# Altium schematic sheet main.SchDoc
size 699 x 699 mm; SheetNumber: 1; SheetTotal: 1
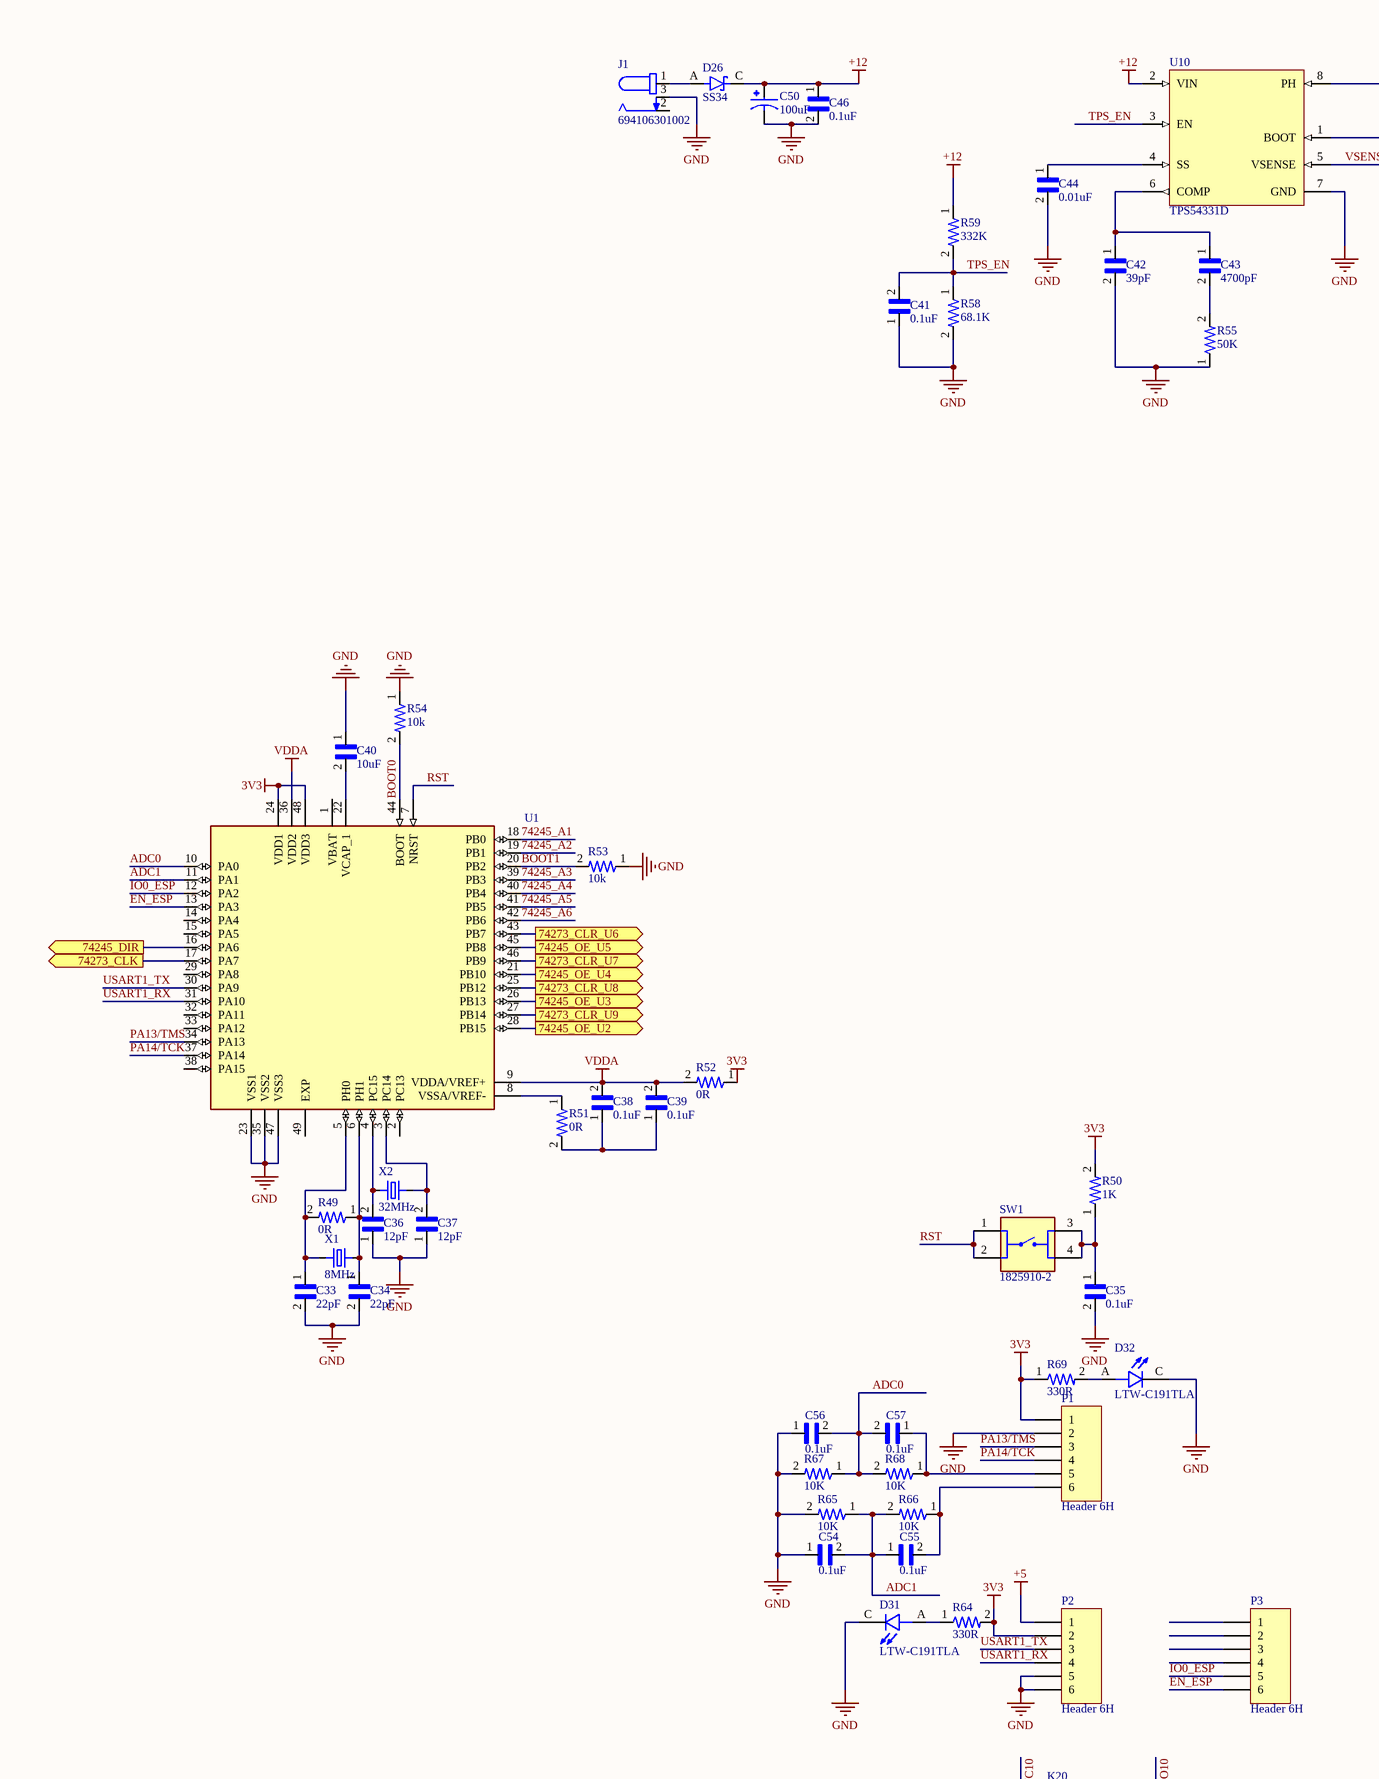
[diagram p0: main.SchDoc, top left]
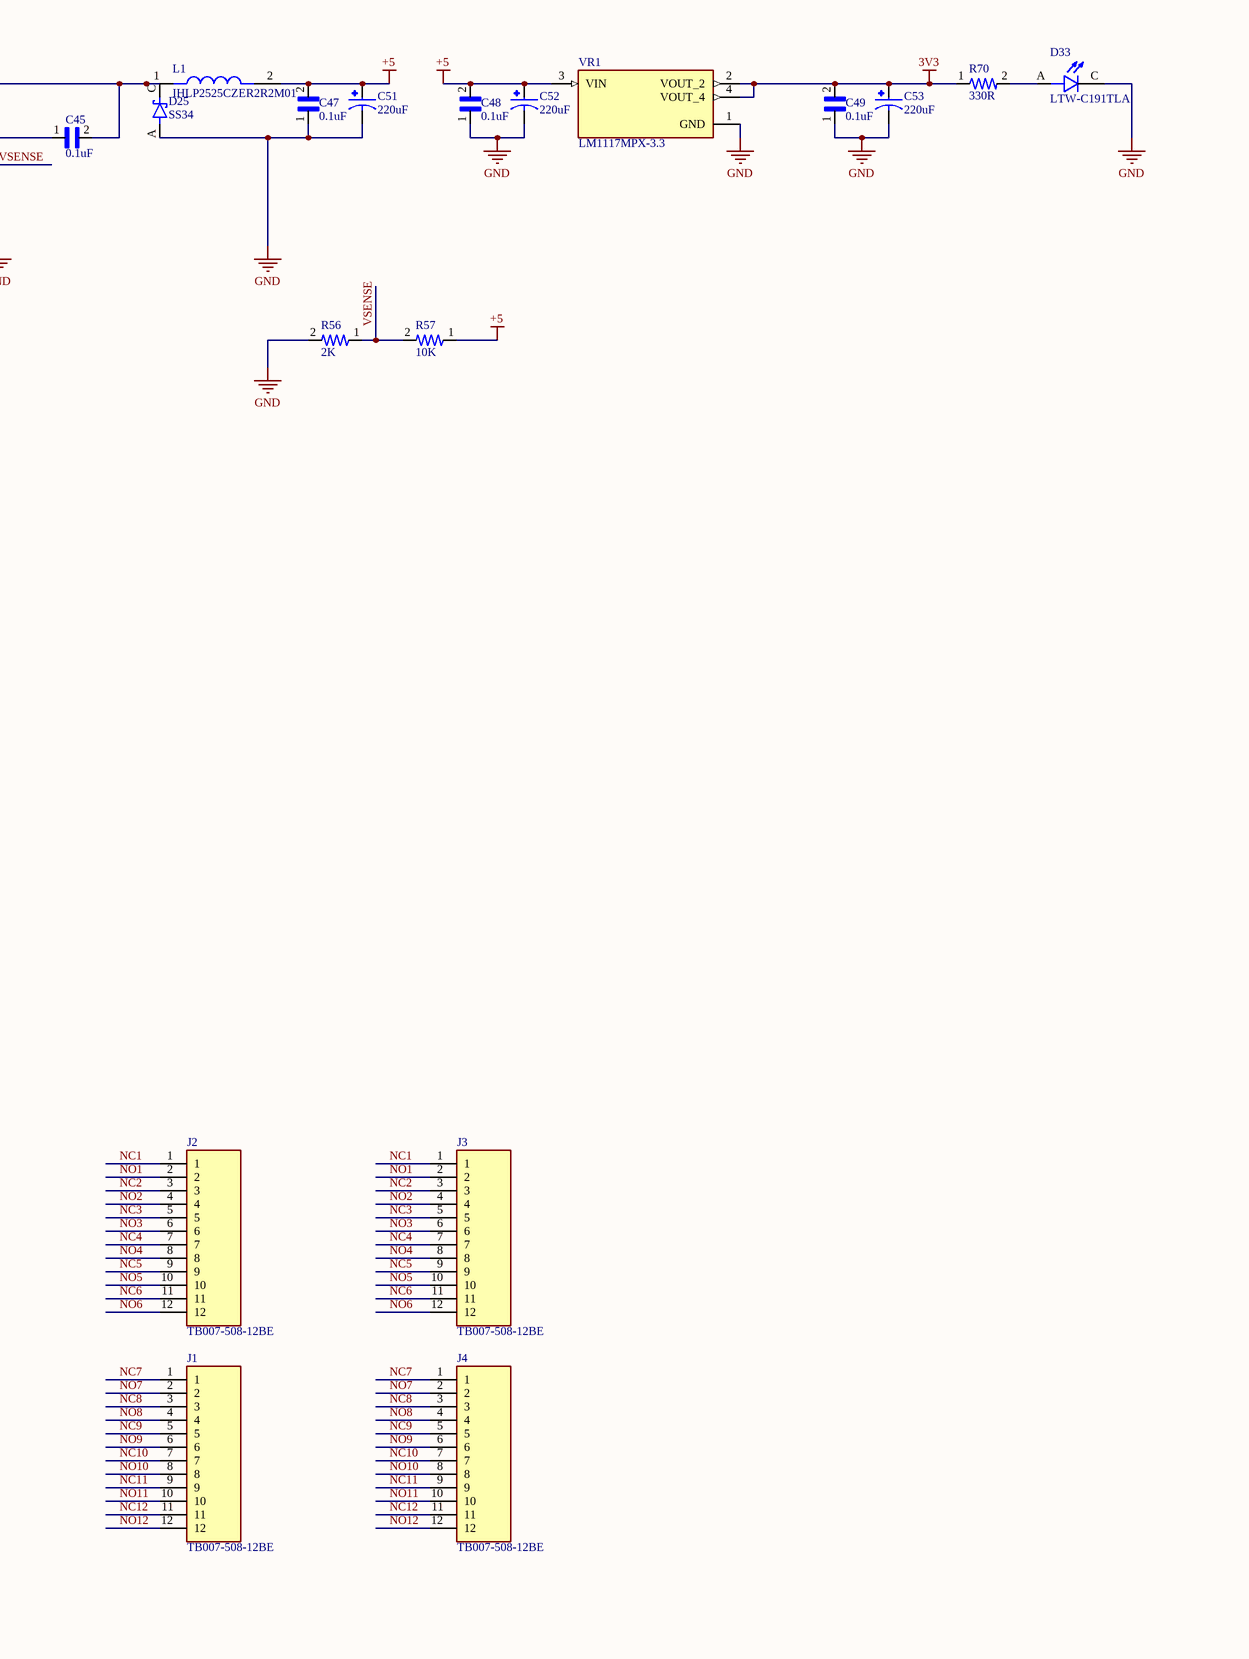
[diagram p1: main.SchDoc, top right]
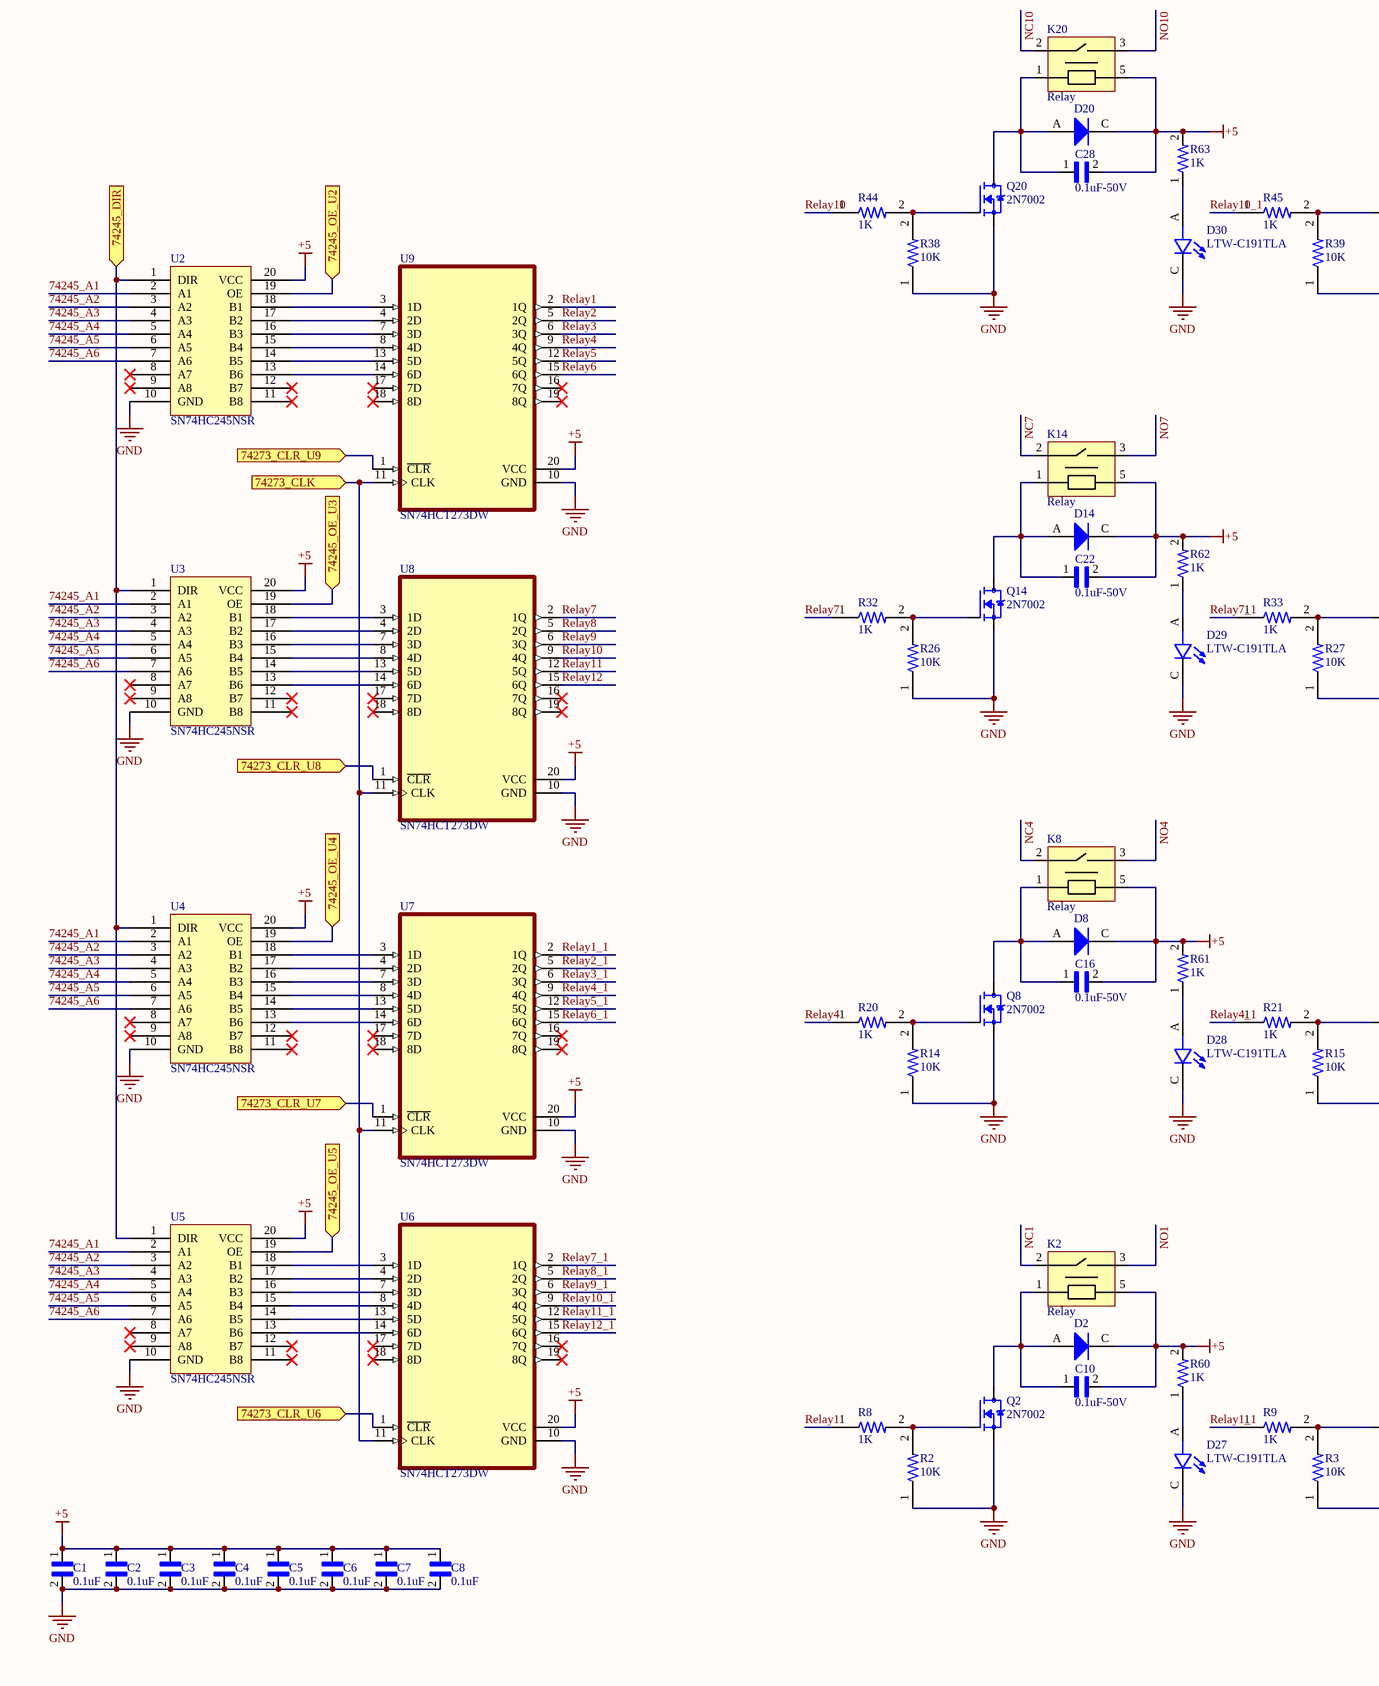
[diagram p2: main.SchDoc, bottom left]
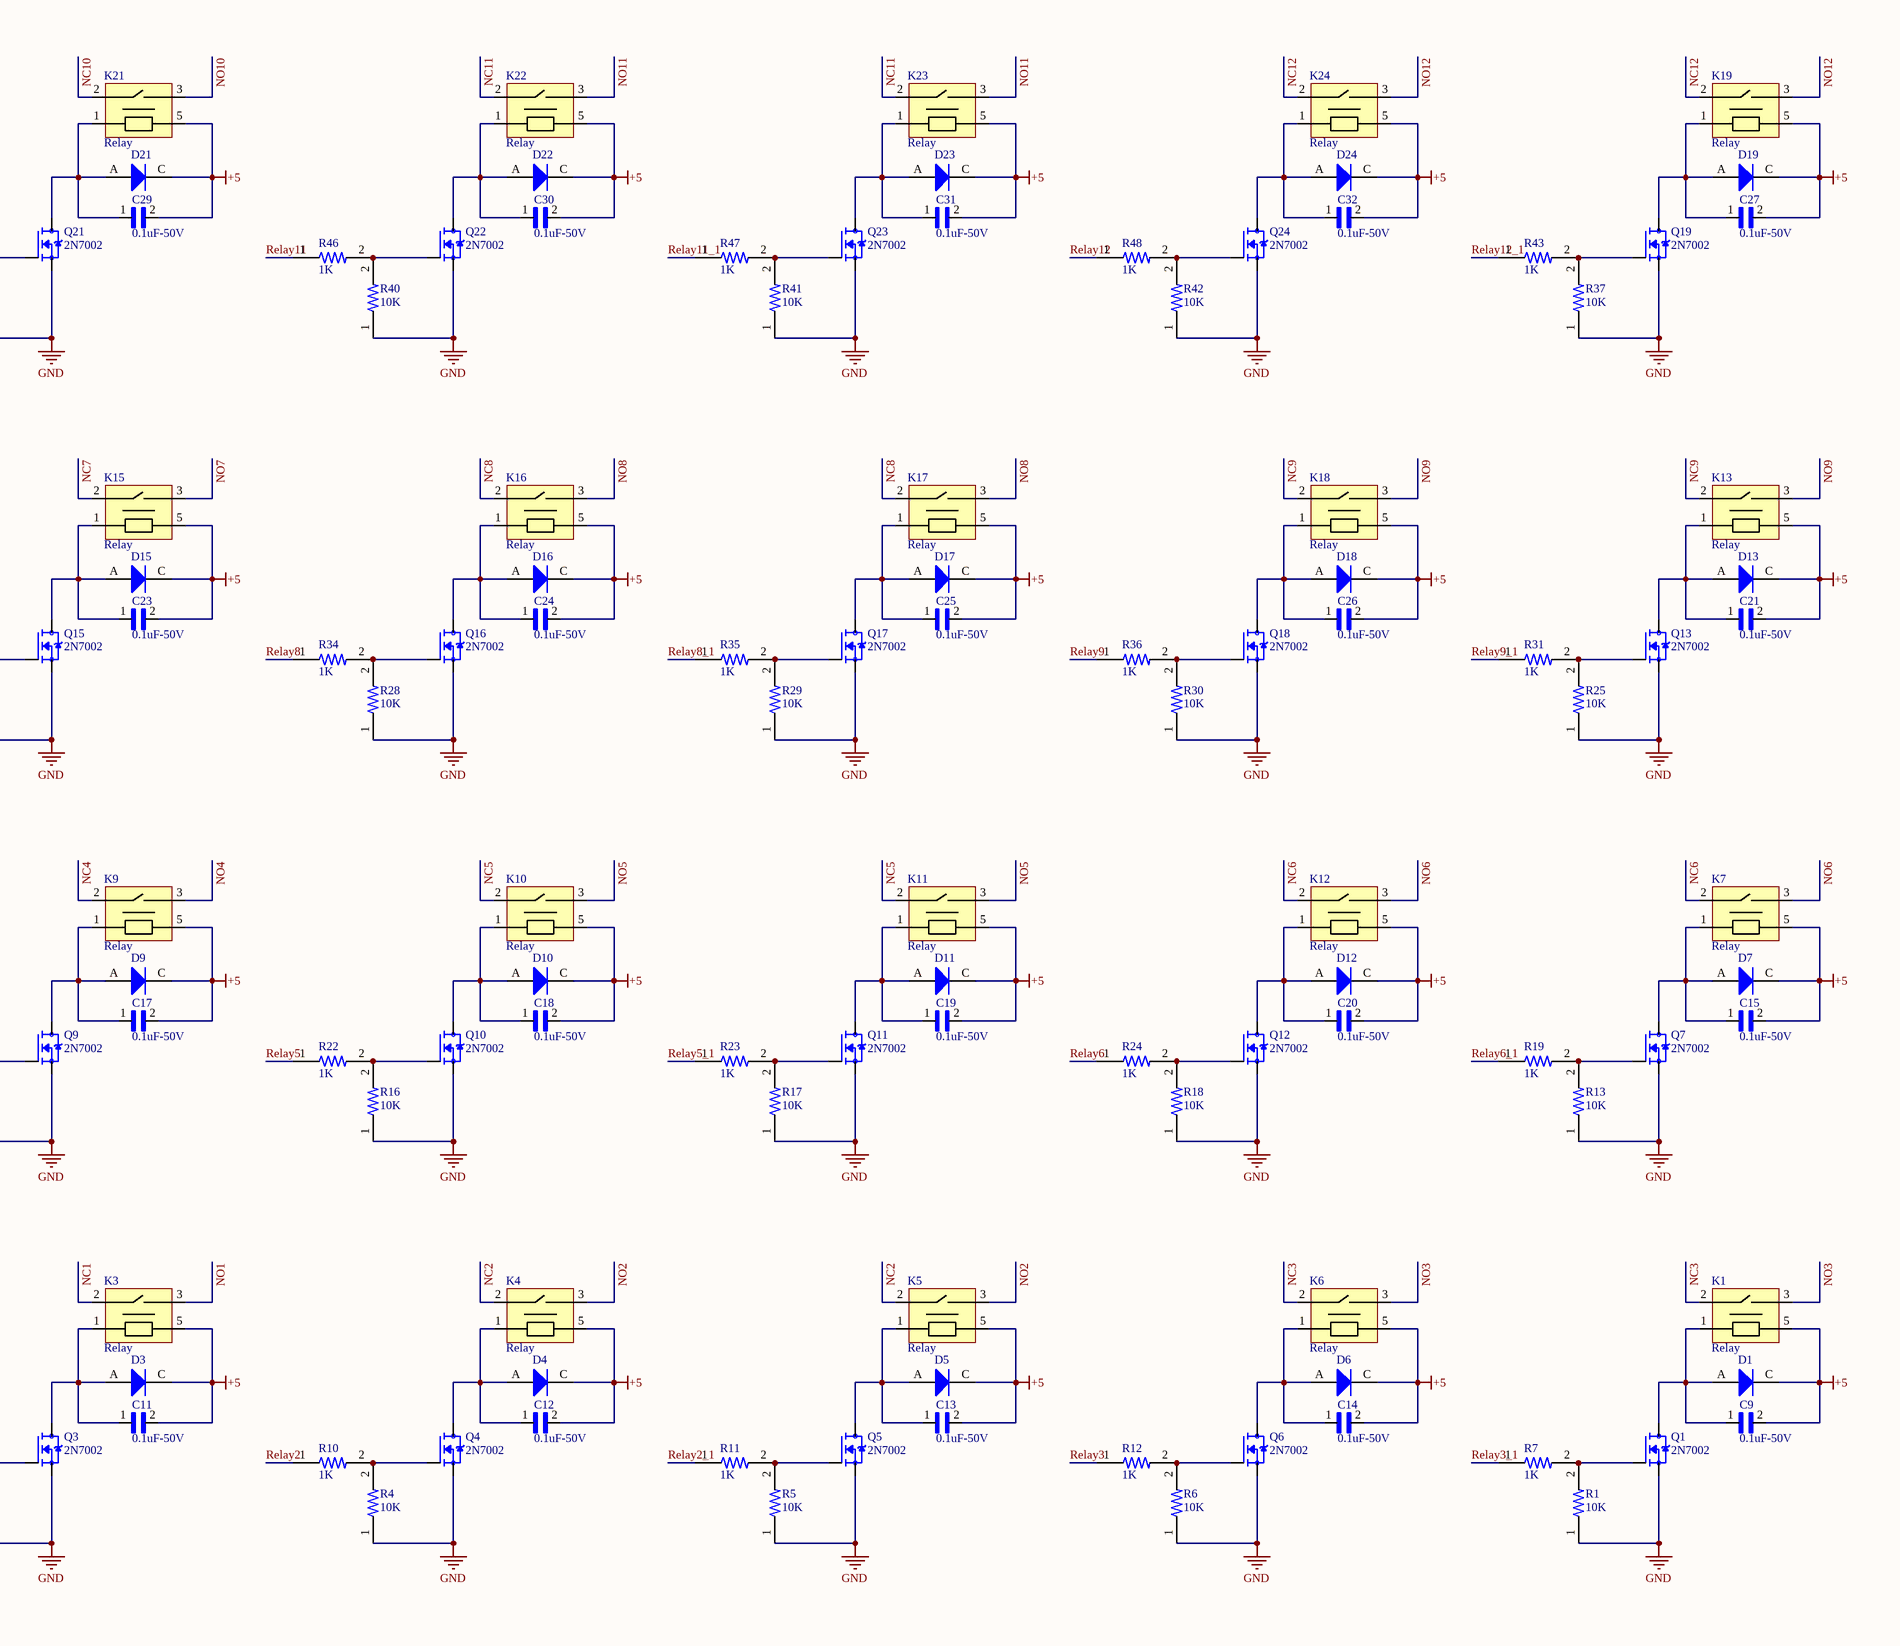
[diagram p3: main.SchDoc, bottom right]

## Parts
(Parts that share a designator on the sheet are numbered #1, #2 ... from top to bottom, then left to right.)
C1  0.1uF  [CAPC1608X90]
C2  0.1uF  [CAPC1608X90]
C3  0.1uF  [CAPC1608X90]
C4  0.1uF  [CAPC1608X90]
C5  0.1uF  [CAPC1608X90]
C6  0.1uF  [CAPC1608X90]
C7  0.1uF  [CAPC1608X90]
C8  0.1uF  [CAPC1608X90]
C9  0.1uF-50V  [CAPC1608X90N]
C10  0.1uF-50V  [CAPC1608X90N]
C11  0.1uF-50V  [CAPC1608X90N]
C12  0.1uF-50V  [CAPC1608X90N]
C13  0.1uF-50V  [CAPC1608X90N]
C14  0.1uF-50V  [CAPC1608X90N]
C15  0.1uF-50V  [CAPC1608X90N]
C16  0.1uF-50V  [CAPC1608X90N]
C17  0.1uF-50V  [CAPC1608X90N]
C18  0.1uF-50V  [CAPC1608X90N]
C19  0.1uF-50V  [CAPC1608X90N]
C20  0.1uF-50V  [CAPC1608X90N]
C21  0.1uF-50V  [CAPC1608X90N]
C22  0.1uF-50V  [CAPC1608X90N]
C23  0.1uF-50V  [CAPC1608X90N]
C24  0.1uF-50V  [CAPC1608X90N]
C25  0.1uF-50V  [CAPC1608X90N]
C26  0.1uF-50V  [CAPC1608X90N]
C27  0.1uF-50V  [CAPC1608X90N]
C28  0.1uF-50V  [CAPC1608X90N]
C29  0.1uF-50V  [CAPC1608X90N]
C30  0.1uF-50V  [CAPC1608X90N]
C31  0.1uF-50V  [CAPC1608X90N]
C32  0.1uF-50V  [CAPC1608X90N]
C33  22pF  [CAPC1608X90]
C34  22pF  [CAPC1608X90]
C35  0.1uF  [CAPC1608X90]
C36  12pF  [CAPC1608X90]
C37  12pF  [CAPC1608X90]
C38  0.1uF  [CAPC1608X90]
C39  0.1uF  [CAPC1608X90]
C40  10uF  [CAPC1608X90]
C41  0.1uF  [CAPC1608X90]
C42  39pF  [CAPC1608X90]
C43  4700pF  [CAPC1608X90]
C44  0.01uF  [CAPC1608X90]
C45  0.1uF  [CAPC1608X90]
C46  0.1uF  [CAPC1608X90]
C47  0.1uF  [CAPC1608X90]
C48  0.1uF  [CAPC1608X90]
C49  0.1uF  [CAPC1608X90]
C50  100uF  [CAP_EEEFKV101XAV]
C51  220uF  [CAP_EEEFN1V221V]
C52  220uF  [CAP_EEEFN1V221V]
C53  220uF  [CAP_EEEFN1V221V]
C54  0.1uF  [CAPC1608X90]
C55  0.1uF  [CAPC1608X90]
C56  0.1uF  [CAPC1608X90]
C57  0.1uF  [CAPC1608X90]
D1  BAS20HT1G  [DIO_1N4148WS-G_RVG]  (value not drawn)
D2  BAS20HT1G  [DIO_1N4148WS-G_RVG]  (value not drawn)
D3  BAS20HT1G  [DIO_1N4148WS-G_RVG]  (value not drawn)
D4  BAS20HT1G  [DIO_1N4148WS-G_RVG]  (value not drawn)
D5  BAS20HT1G  [DIO_1N4148WS-G_RVG]  (value not drawn)
D6  BAS20HT1G  [DIO_1N4148WS-G_RVG]  (value not drawn)
D7  BAS20HT1G  [DIO_1N4148WS-G_RVG]  (value not drawn)
D8  BAS20HT1G  [DIO_1N4148WS-G_RVG]  (value not drawn)
D9  BAS20HT1G  [DIO_1N4148WS-G_RVG]  (value not drawn)
D10  BAS20HT1G  [DIO_1N4148WS-G_RVG]  (value not drawn)
D11  BAS20HT1G  [DIO_1N4148WS-G_RVG]  (value not drawn)
D12  BAS20HT1G  [DIO_1N4148WS-G_RVG]  (value not drawn)
D13  BAS20HT1G  [DIO_1N4148WS-G_RVG]  (value not drawn)
D14  BAS20HT1G  [DIO_1N4148WS-G_RVG]  (value not drawn)
D15  BAS20HT1G  [DIO_1N4148WS-G_RVG]  (value not drawn)
D16  BAS20HT1G  [DIO_1N4148WS-G_RVG]  (value not drawn)
D17  BAS20HT1G  [DIO_1N4148WS-G_RVG]  (value not drawn)
D18  BAS20HT1G  [DIO_1N4148WS-G_RVG]  (value not drawn)
D19  BAS20HT1G  [DIO_1N4148WS-G_RVG]  (value not drawn)
D20  BAS20HT1G  [DIO_1N4148WS-G_RVG]  (value not drawn)
D21  BAS20HT1G  [DIO_1N4148WS-G_RVG]  (value not drawn)
D22  BAS20HT1G  [DIO_1N4148WS-G_RVG]  (value not drawn)
D23  BAS20HT1G  [DIO_1N4148WS-G_RVG]  (value not drawn)
D24  BAS20HT1G  [DIO_1N4148WS-G_RVG]  (value not drawn)
D25  SS34  [DIOM7959X265N]
D26  SS34  [DIOM7959X265N]
D27  LTW-C191TLA  [LEDC1608X65N]
D28  LTW-C191TLA  [LEDC1608X65N]
D29  LTW-C191TLA  [LEDC1608X65N]
D30  LTW-C191TLA  [LEDC1608X65N]
D31  LTW-C191TLA  [LEDC1608X65N]
D32  LTW-C191TLA  [LEDC1608X65N]
D33  LTW-C191TLA  [LEDC1608X65N]
J1#1  694106301002  [69410X301002]
J1#2  TB007-508-12BE  [CUI_TB007-508-12BE]
J2  TB007-508-12BE  [CUI_TB007-508-12BE]
J3  TB007-508-12BE  [CUI_TB007-508-12BE]
J4  TB007-508-12BE  [CUI_TB007-508-12BE]
K1  Relay  [Relay]
K2  Relay  [Relay]
K3  Relay  [Relay]
K4  Relay  [Relay]
K5  Relay  [Relay]
K6  Relay  [Relay]
K7  Relay  [Relay]
K8  Relay  [Relay]
K9  Relay  [Relay]
K10  Relay  [Relay]
K11  Relay  [Relay]
K12  Relay  [Relay]
K13  Relay  [Relay]
K14  Relay  [Relay]
K15  Relay  [Relay]
K16  Relay  [Relay]
K17  Relay  [Relay]
K18  Relay  [Relay]
K19  Relay  [Relay]
K20  Relay  [Relay]
K21  Relay  [Relay]
K22  Relay  [Relay]
K23  Relay  [Relay]
K24  Relay  [Relay]
L1  IHLP2525CZER2R2M01  [INDM686X647X300N]
P1  Header 6H  [HDR1X6H]
P2  Header 6H  [HDR1X6H]
P3  Header 6H  [HDR1X6H]
Q1  2N7002  [SOT95P240X111-3N]
Q2  2N7002  [SOT95P240X111-3N]
Q3  2N7002  [SOT95P240X111-3N]
Q4  2N7002  [SOT95P240X111-3N]
Q5  2N7002  [SOT95P240X111-3N]
Q6  2N7002  [SOT95P240X111-3N]
Q7  2N7002  [SOT95P240X111-3N]
Q8  2N7002  [SOT95P240X111-3N]
Q9  2N7002  [SOT95P240X111-3N]
Q10  2N7002  [SOT95P240X111-3N]
Q11  2N7002  [SOT95P240X111-3N]
Q12  2N7002  [SOT95P240X111-3N]
Q13  2N7002  [SOT95P240X111-3N]
Q14  2N7002  [SOT95P240X111-3N]
Q15  2N7002  [SOT95P240X111-3N]
Q16  2N7002  [SOT95P240X111-3N]
Q17  2N7002  [SOT95P240X111-3N]
Q18  2N7002  [SOT95P240X111-3N]
Q19  2N7002  [SOT95P240X111-3N]
Q20  2N7002  [SOT95P240X111-3N]
Q21  2N7002  [SOT95P240X111-3N]
Q22  2N7002  [SOT95P240X111-3N]
Q23  2N7002  [SOT95P240X111-3N]
Q24  2N7002  [SOT95P240X111-3N]
R1  10K  [RESC1608X50N]
R2  10K  [RESC1608X50N]
R3  10K  [RESC1608X50N]
R4  10K  [RESC1608X50N]
R5  10K  [RESC1608X50N]
R6  10K  [RESC1608X50N]
R7  1K  [RESC1608X50N]
R8  1K  [RESC1608X50N]
R9  1K  [RESC1608X50N]
R10  1K  [RESC1608X50N]
R11  1K  [RESC1608X50N]
R12  1K  [RESC1608X50N]
R13  10K  [RESC1608X50N]
R14  10K  [RESC1608X50N]
R15  10K  [RESC1608X50N]
R16  10K  [RESC1608X50N]
R17  10K  [RESC1608X50N]
R18  10K  [RESC1608X50N]
R19  1K  [RESC1608X50N]
R20  1K  [RESC1608X50N]
R21  1K  [RESC1608X50N]
R22  1K  [RESC1608X50N]
R23  1K  [RESC1608X50N]
R24  1K  [RESC1608X50N]
R25  10K  [RESC1608X50N]
R26  10K  [RESC1608X50N]
R27  10K  [RESC1608X50N]
R28  10K  [RESC1608X50N]
R29  10K  [RESC1608X50N]
R30  10K  [RESC1608X50N]
R31  1K  [RESC1608X50N]
R32  1K  [RESC1608X50N]
R33  1K  [RESC1608X50N]
R34  1K  [RESC1608X50N]
R35  1K  [RESC1608X50N]
R36  1K  [RESC1608X50N]
R37  10K  [RESC1608X50N]
R38  10K  [RESC1608X50N]
R39  10K  [RESC1608X50N]
R40  10K  [RESC1608X50N]
R41  10K  [RESC1608X50N]
R42  10K  [RESC1608X50N]
R43  1K  [RESC1608X50N]
R44  1K  [RESC1608X50N]
R45  1K  [RESC1608X50N]
R46  1K  [RESC1608X50N]
R47  1K  [RESC1608X50N]
R48  1K  [RESC1608X50N]
R49  0R  [RESC1608X50N]
R50  1K  [RESC1608X50N]
R51  0R  [RESC1608X50N]
R52  0R  [RESC1608X50N]
R53  10k  [RESC1608X50N]
R54  10k  [RESC1608X50N]
R55  50K  [RESC1608X50N]
R56  2K  [RESC1608X50N]
R57  10K  [RESC1608X50N]
R58  68.1K  [RESC1608X50N]
R59  332K  [RESC1608X50N]
R60  1K  [RESC1608X50N]
R61  1K  [RESC1608X50N]
R62  1K  [RESC1608X50N]
R63  1K  [RESC1608X50N]
R64  330R  [RESC1608X50N]
R65  10K  [RESC1608X50N]
R66  10K  [RESC1608X50N]
R67  10K  [RESC1608X50N]
R68  10K  [RESC1608X50N]
R69  330R  [RESC1608X50N]
R70  330R  [RESC1608X50N]
SW1  1825910-2  [TE_1825910-2]
U1  STM32F410CBU6  [QFP50P900X900X160-48N]  (value not drawn)
U2  SN74HC245NSR  [SOP127P780X200-20N]
U3  SN74HC245NSR  [SOP127P780X200-20N]
U4  SN74HC245NSR  [SOP127P780X200-20N]
U5  SN74HC245NSR  [SOP127P780X200-20N]
U6  SN74HCT273DW  [SOIC127P1030X265-20N]
U7  SN74HCT273DW  [SOIC127P1030X265-20N]
U8  SN74HCT273DW  [SOIC127P1030X265-20N]
U9  SN74HCT273DW  [SOIC127P1030X265-20N]
U10  TPS54331D  [SOIC127P599X175-8N]
VR1  LM1117MPX-3.3  [VREG_LM1117MPX-3.3]
X1  8MHz  [XTAL_ECS-320-18-4XEN]
X2  32MHz  [XTAL_ECS-320-18-4XEN]

## Ports
74245_DIR (in), 74245_DIR (out), 74245_OE_U2 (in), 74245_OE_U2 (out), 74245_OE_U3 (in), 74245_OE_U3 (out), 74245_OE_U4 (in), 74245_OE_U4 (out), 74245_OE_U5 (in), 74245_OE_U5 (out), 74273_CLK (in), 74273_CLK (out), 74273_CLR_U6 (in), 74273_CLR_U6 (out), 74273_CLR_U7 (in), 74273_CLR_U7 (out), 74273_CLR_U8 (in), 74273_CLR_U8 (out), 74273_CLR_U9 (in), 74273_CLR_U9 (out)

## Nets
3V3: C49.2 C53.1 P1.1 P2.2 R50.2 R52.1 R64.2 R69.1 R70.1 U1.24(VDD1) U1.48(VDD3) VR1.2(VOUT_2) VR1.4(VOUT_4)
+5: C1.1 C2.1 C3.1 C4.1 C5.1 C6.1 C7.1 C8.1 C9.2 C10.2 C11.2 C12.2 C13.2 C14.2 C15.2 C16.2 C17.2 C18.2 C19.2 C20.2 C21.2 C22.2 C23.2 C24.2 C25.2 C26.2 C27.2 C28.2 C29.2 C30.2 C31.2 C32.2 C47.2 C48.2 C51.1 C52.1 D1.C D2.C D3.C D4.C D5.C D6.C D7.C D8.C D9.C D10.C D11.C D12.C D13.C D14.C D15.C D16.C D17.C D18.C D19.C D20.C D21.C D22.C D23.C D24.C K1.5 K2.5 K3.5 K4.5 K5.5 K6.5 K7.5 K8.5 K9.5 K10.5 K11.5 K12.5 K13.5 K14.5 K15.5 K16.5 K17.5 K18.5 K19.5 K20.5 K21.5 K22.5 K23.5 K24.5 L1.2 P2.1 R57.1 R60.2 R61.2 R62.2 R63.2 U2.20(VCC) U3.20(VCC) U4.20(VCC) U5.20(VCC) U6.20(VCC) U7.20(VCC) U8.20(VCC) U9.20(VCC) VR1.3(VIN)
+12: C46.1 C50.1 D26.C(K) R59.1 U10.2(VIN)
GND: C1.2 C2.2 C3.2 C4.2 C5.2 C6.2 C7.2 C8.2 C33.2 C34.2 C35.2 C36.1 C37.1 C40.1 C41.1 C42.2 C44.2 C46.2 C47.1 C48.1 C49.1 C50.2 C51.2 C52.2 C53.2 C54.1 C56.1 D25.A D27.C D28.C D29.C D30.C D31.C D32.C D33.C J1#1.3 P1.2 P2.5 P2.6 Q1.2(S) Q2.2(S) Q3.2(S) Q4.2(S) Q5.2(S) Q6.2(S) Q7.2(S) Q8.2(S) Q9.2(S) Q10.2(S) Q11.2(S) Q12.2(S) Q13.2(S) Q14.2(S) Q15.2(S) Q16.2(S) Q17.2(S) Q18.2(S) Q19.2(S) Q20.2(S) Q21.2(S) Q22.2(S) Q23.2(S) Q24.2(S) R1.1 R2.1 R3.1 R4.1 R5.1 R6.1 R13.1 R14.1 R15.1 R16.1 R17.1 R18.1 R25.1 R26.1 R27.1 R28.1 R29.1 R30.1 R37.1 R38.1 R39.1 R40.1 R41.1 R42.1 R53.1 R54.1 R55.1 R56.2 R58.2 R65.2 R67.2 U1.23(VSS1) U1.35(VSS2) U1.47(VSS3) U2.10(GND) U3.10(GND) U4.10(GND) U5.10(GND) U6.10(GND) U7.10(GND) U8.10(GND) U9.10(GND) U10.7(GND) VR1.1(GND)
VDDA: C38.2 C39.2 R52.2 U1.9(VDDA/VREF+) U1.36(VDD2)
74245_A1: U1.18(PB0) U2.2(A1) U3.2(A1) U4.2(A1) U5.2(A1)
74245_A2: U1.19(PB1) U2.3(A2) U3.3(A2) U4.3(A2) U5.3(A2)
74245_A3: U1.39(PB3) U2.4(A3) U3.4(A3) U4.4(A3) U5.4(A3)
74245_A4: U1.40(PB4) U2.5(A4) U3.5(A4) U4.5(A4) U5.5(A4)
74245_A5: U1.41(PB5) U2.6(A5) U3.6(A5) U4.6(A5) U5.6(A5)
74245_A6: U1.42(PB6) U2.7(A6) U3.7(A6) U4.7(A6) U5.7(A6)
74245_DIR: U1.16(PA6) U2.1(DIR) U3.1(DIR) U4.1(DIR) U5.1(DIR) ; port 74245_DIR
74245_OE_U2: U1.28(PB15) U2.19(OE) ; port 74245_OE_U2
74245_OE_U3: U1.26(PB13) U3.19(OE) ; port 74245_OE_U3
74245_OE_U4: U1.21(PB10) U4.19(OE) ; port 74245_OE_U4
74245_OE_U5: U1.45(PB8) U5.19(OE) ; port 74245_OE_U5
74273_CLK: U1.17(PA7) U6.11(CLK) U7.11(CLK) U8.11(CLK) U9.11(CLK) ; port 74273_CLK
74273_CLR_U6: U1.43(PB7) U6.1(~{CLR}) ; port 74273_CLR_U6
74273_CLR_U7: U1.46(PB9) U7.1(~{CLR}) ; port 74273_CLR_U7
74273_CLR_U8: U1.25(PB12) U8.1(~{CLR}) ; port 74273_CLR_U8
74273_CLR_U9: U1.27(PB14) U9.1(~{CLR}) ; port 74273_CLR_U9
ADC0: C56.2 C57.2 R67.1 R68.2 U1.10(PA0)
ADC1: C54.2 C55.1 R65.1 R66.2 U1.11(PA1)
BOOT0: R54.2 U1.44(BOOT)
BOOT1: R53.2 U1.20(PB2)
EN_ESP: P3.6 U1.13(PA3)
IO0_ESP: P3.5 U1.12(PA2)
NC1: J2.1 J3.1 K2.2 K3.2
NC2: J2.3 J3.3 K4.2 K5.2
NC3: J2.5 J3.5 K1.2 K6.2
NC4: J2.7 J3.7 K8.2 K9.2
NC5: J2.9 J3.9 K10.2 K11.2
NC6: J2.11 J3.11 K7.2 K12.2
NC7: J1#2.1 J4.1 K14.2 K15.2
NC8: J1#2.3 J4.3 K16.2 K17.2
NC9: J1#2.5 J4.5 K13.2 K18.2
NC10: J1#2.7 J4.7 K20.2 K21.2
NC11: J1#2.9 J4.9 K22.2 K23.2
NC12: J1#2.11 J4.11 K19.2 K24.2
NO1: J2.2 J3.2 K2.3 K3.3
NO2: J2.4 J3.4 K4.3 K5.3
NO3: J2.6 J3.6 K1.3 K6.3
NO4: J2.8 J3.8 K8.3 K9.3
NO5: J2.10 J3.10 K10.3 K11.3
NO6: J2.12 J3.12 K7.3 K12.3
NO7: J1#2.2 J4.2 K14.3 K15.3
NO8: J1#2.4 J4.4 K16.3 K17.3
NO9: J1#2.6 J4.6 K13.3 K18.3
NO10: J1#2.8 J4.8 K20.3 K21.3
NO11: J1#2.10 J4.10 K22.3 K23.3
NO12: J1#2.12 J4.12 K19.3 K24.3
PA13/TMS: P1.3 U1.34(PA13)
PA14/TCK: P1.4 U1.37(PA14)
Relay1: R8.1 U9.2(1Q)
Relay1_1: R9.1 U7.2(1Q)
Relay2: R10.1 U9.5(2Q)
Relay2_1: R11.1 U7.5(2Q)
Relay3: R12.1 U9.6(3Q)
Relay3_1: R7.1 U7.6(3Q)
Relay4: R20.1 U9.9(4Q)
Relay4_1: R21.1 U7.9(4Q)
Relay5: R22.1 U9.12(5Q)
Relay5_1: R23.1 U7.12(5Q)
Relay6: R24.1 U9.15(6Q)
Relay6_1: R19.1 U7.15(6Q)
Relay7: R32.1 U8.2(1Q)
Relay7_1: R33.1 U6.2(1Q)
Relay8: R34.1 U8.5(2Q)
Relay8_1: R35.1 U6.5(2Q)
Relay9: R36.1 U8.6(3Q)
Relay9_1: R31.1 U6.6(3Q)
Relay10: R44.1 U8.9(4Q)
Relay10_1: R45.1 U6.9(4Q)
Relay11: R46.1 U8.12(5Q)
Relay11_1: R47.1 U6.12(5Q)
Relay12: R48.1 U8.15(6Q)
Relay12_1: R43.1 U6.15(6Q)
RST: SW1.1 SW1.2 U1.7(NRST)
TPS_EN: C41.2 R58.1 R59.2 U10.3(EN)
USART1_RX: P2.4 U1.31(PA10)
USART1_TX: P2.3 U1.30(PA9)
VSENSE: R56.1 R57.2 U10.5(VSENSE)
NetC9_1: C9.1 D1.A K1.1 Q1.3(D)
NetC10_1: C10.1 D2.A K2.1 Q2.3(D)
NetC11_1: C11.1 D3.A K3.1 Q3.3(D)
NetC12_1: C12.1 D4.A K4.1 Q4.3(D)
NetC13_1: C13.1 D5.A K5.1 Q5.3(D)
NetC14_1: C14.1 D6.A K6.1 Q6.3(D)
NetC15_1: C15.1 D7.A K7.1 Q7.3(D)
NetC16_1: C16.1 D8.A K8.1 Q8.3(D)
NetC17_1: C17.1 D9.A K9.1 Q9.3(D)
NetC18_1: C18.1 D10.A K10.1 Q10.3(D)
NetC19_1: C19.1 D11.A K11.1 Q11.3(D)
NetC20_1: C20.1 D12.A K12.1 Q12.3(D)
NetC21_1: C21.1 D13.A K13.1 Q13.3(D)
NetC22_1: C22.1 D14.A K14.1 Q14.3(D)
NetC23_1: C23.1 D15.A K15.1 Q15.3(D)
NetC24_1: C24.1 D16.A K16.1 Q16.3(D)
NetC25_1: C25.1 D17.A K17.1 Q17.3(D)
NetC26_1: C26.1 D18.A K18.1 Q18.3(D)
NetC27_1: C27.1 D19.A K19.1 Q19.3(D)
NetC28_1: C28.1 D20.A K20.1 Q20.3(D)
NetC29_1: C29.1 D21.A K21.1 Q21.3(D)
NetC30_1: C30.1 D22.A K22.1 Q22.3(D)
NetC31_1: C31.1 D23.A K23.1 Q23.3(D)
NetC32_1: C32.1 D24.A K24.1 Q24.3(D)
NetC33_1: C33.1 R49.2 U1.5(PH0) X1.2
NetC34_1: C34.1 R49.1 U1.6(PH1) X1.1
NetC35_1: C35.1 R50.1 SW1.3 SW1.4
NetC36_2: C36.2 U1.4(PC15) X2.1
NetC37_2: C37.2 U1.3(PC14) X2.2
NetC38_1: C38.1 C39.1 R51.2
NetC40_2: C40.2 U1.22(VCAP_1)
NetC42_1: C42.1 C43.1 U10.6(COMP)
NetC43_2: C43.2 R55.2
NetC44_1: C44.1 U10.4(SS)
NetC45_1: C45.1 U10.1(BOOT)
NetC45_2: C45.2 D25.C(K) L1.1 U10.8(PH)
NetC55_2: C55.2 P1.6 R66.1
NetC57_1: C57.1 P1.5 R68.1
NetD26_A: D26.A J1#1.1
NetD27_A: D27.A R60.1
NetD28_A: D28.A R61.1
NetD29_A: D29.A R62.1
NetD30_A: D30.A R63.1
NetD31_A: D31.A R64.1
NetD32_A: D32.A R69.2
NetD33_A: D33.A R70.2
NetQ1_1: Q1.1(G) R1.2 R7.2
NetQ2_1: Q2.1(G) R2.2 R8.2
NetQ3_1: Q3.1(G) R3.2 R9.2
NetQ4_1: Q4.1(G) R4.2 R10.2
NetQ5_1: Q5.1(G) R5.2 R11.2
NetQ6_1: Q6.1(G) R6.2 R12.2
NetQ7_1: Q7.1(G) R13.2 R19.2
NetQ8_1: Q8.1(G) R14.2 R20.2
NetQ9_1: Q9.1(G) R15.2 R21.2
NetQ10_1: Q10.1(G) R16.2 R22.2
NetQ11_1: Q11.1(G) R17.2 R23.2
NetQ12_1: Q12.1(G) R18.2 R24.2
NetQ13_1: Q13.1(G) R25.2 R31.2
NetQ14_1: Q14.1(G) R26.2 R32.2
NetQ15_1: Q15.1(G) R27.2 R33.2
NetQ16_1: Q16.1(G) R28.2 R34.2
NetQ17_1: Q17.1(G) R29.2 R35.2
NetQ18_1: Q18.1(G) R30.2 R36.2
NetQ19_1: Q19.1(G) R37.2 R43.2
NetQ20_1: Q20.1(G) R38.2 R44.2
NetQ21_1: Q21.1(G) R39.2 R45.2
NetQ22_1: Q22.1(G) R40.2 R46.2
NetQ23_1: Q23.1(G) R41.2 R47.2
NetQ24_1: Q24.1(G) R42.2 R48.2
NetR51_1: R51.1 U1.8(VSSA/VREF-)
NetU2_13: U2.13(B6) U9.14(6D)
NetU2_14: U2.14(B5) U9.13(5D)
NetU2_15: U2.15(B4) U9.8(4D)
NetU2_16: U2.16(B3) U9.7(3D)
NetU2_17: U2.17(B2) U9.4(2D)
NetU2_18: U2.18(B1) U9.3(1D)
NetU3_13: U3.13(B6) U8.14(6D)
NetU3_14: U3.14(B5) U8.13(5D)
NetU3_15: U3.15(B4) U8.8(4D)
NetU3_16: U3.16(B3) U8.7(3D)
NetU3_17: U3.17(B2) U8.4(2D)
NetU3_18: U3.18(B1) U8.3(1D)
NetU4_13: U4.13(B6) U7.14(6D)
NetU4_14: U4.14(B5) U7.13(5D)
NetU4_15: U4.15(B4) U7.8(4D)
NetU4_16: U4.16(B3) U7.7(3D)
NetU4_17: U4.17(B2) U7.4(2D)
NetU4_18: U4.18(B1) U7.3(1D)
NetU5_13: U5.13(B6) U6.14(6D)
NetU5_14: U5.14(B5) U6.13(5D)
NetU5_15: U5.15(B4) U6.8(4D)
NetU5_16: U5.16(B3) U6.7(3D)
NetU5_17: U5.17(B2) U6.4(2D)
NetU5_18: U5.18(B1) U6.3(1D)

Not connected (* = marked no-connect by the designer): J1#1 2; P3 1 2 3 4; U1 1(VBAT) 2(PC13) 14(PA4) 15(PA5) 29(PA8) 32(PA11) 33(PA12) 38(PA15) 49(EXP); U2 8(A7)* 9(A8)* 11(B8)* 12(B7)*; U3 8(A7)* 9(A8)* 11(B8)* 12(B7)*; U4 8(A7)* 9(A8)* 11(B8)* 12(B7)*; U5 8(A7)* 9(A8)* 11(B8)* 12(B7)*; U6 16(7Q)* 17(7D)* 18(8D)* 19(8Q)*; U7 16(7Q)* 17(7D)* 18(8D)* 19(8Q)*; U8 16(7Q)* 17(7D)* 18(8D)* 19(8Q)*; U9 16(7Q)* 17(7D)* 18(8D)* 19(8Q)*

## Library data of the parts
C1-C8 C35 C38 C39 C41 C45-C49 C54-C57 = LD034C222KAB2A: Cap Ceramic 0.1uF 4V X7R 10% SMD 0603 125Â°C T/R; MF: {'manufacturer': u'AVX'}; Price: None; Availability: Unavailable; Value: *; MP: LD034C222KAB2A; Package: None
C9-C32 = CL10B104KB8NNNC: CAP CER 0.1UF 50V X7R 0603; MF: {'manufacturer': u'Samsung Electro-Mechanics'}; Availability: Unavailable; Price: None; MP: CL10B104KB8NNNC; Value: *; Package: None
C33 C34 = LD034C222KAB2A: Cap Ceramic 22pF 4V X7R 10% SMD 0603 125Â°C T/R; MF: {'manufacturer': u'AVX'}; Price: None; Availability: Unavailable; Value: *; MP: LD034C222KAB2A; Package: None
C36 C37 = LD034C222KAB2A: Cap Ceramic 12pF 4V X7R 10% SMD 0603 125Â°C T/R; MF: {'manufacturer': u'AVX'}; Price: None; Availability: Unavailable; Value: *; MP: LD034C222KAB2A; Package: None
C40 = LD034C222KAB2A: Cap Ceramic 10uF 4V X7R 10% SMD 0603 125Â°C T/R; MF: {'manufacturer': u'AVX'}; Price: None; Availability: Unavailable; Value: *; MP: LD034C222KAB2A; Package: None
C42 = LD034C222KAB2A: Cap Ceramic 39pF 4V X7R 10% SMD 0603 125Â°C T/R; MF: {'manufacturer': u'AVX'}; Price: None; Availability: Unavailable; Value: *; MP: LD034C222KAB2A; Package: None
C43 = LD034C222KAB2A: Cap Ceramic 4700pF 4V X7R 10% SMD 0603 125Â°C T/R; MF: {'manufacturer': u'AVX'}; Price: None; Availability: Unavailable; Value: *; MP: LD034C222KAB2A; Package: None
C44 = LD034C222KAB2A: Cap Ceramic 0.01uF 4V X7R 10% SMD 0603 125Â°C T/R; MF: {'manufacturer': u'AVX'}; Price: None; Availability: Unavailable; Value: *; MP: LD034C222KAB2A; Package: None
C50 = EEEFKV101XAV: MF: {'manufacturer': u'Panasonic'}; Price: None; MP: EEEFKV101XAV; Value: *; Availability: Unavailable; Package: None
C51-C53 = EEEFN1V221V: MF: {'manufacturer': u'Panasonic'}; Price: None; Value: *; Package: None; MP: EEEFN1V221V; Availability: Unavailable
D25 D26 = SS34: Diode Schottky 40V 3A 2-Pin SMC T/R; MF: {'manufacturer': u'ON Semiconductor'}; Price: None; Availability: Unavailable; Value: *; MP: SS34; Package: None
D27-D33 = LTW-C191TLA: CHIP LED WHITE 0603 TOP VIEW; MF: {'manufacturer': u'Lite-On'}; Value: *; Availability: Unavailable; Price: None; Package: None; MP: LTW-C191TLA
J1#1 = 694106301002: <b>WR-DC_DC Power Jack_Right Angled_THT Center Pin Ã˜2.0_Plug ID Ã˜2.05_Plug OD Ã˜5.5 ;</b>=>Code : Con_WR-DC_THT_694108301002_694106301002 <p><a href="http://katalog.we-online.de/media/images/v2/Family_WR-DC_DC_Power_Jack_Right_Angled_THT_69410x301002.jpg"> <img src="http://katalog.we-online.de/media/images/v2/Family_WR-DC_DC_Power_Jack_Right_Angled_THT_69410x301002.jpg" width="320"></a><p> Details see: <a href="http://katalog.we-online.de/em/datasheet/6941xx301002.pdf">http://katalog.we-online.de/em/datasheet/6941xx301002.pdf</a><p> Created 2014-10-08, Karrer Zheng<br> 2014 (C) Wurth Elektronik; MF: {'manufacturer': u'Wurth Electronics'}; Package: None; Price: None; Availability: Unavailable; MP: 694106301002; Value: *
J1#2 J2-J4 = TB007-508-12BE: MF: {'manufacturer': u'CUI Devices'}; Package: None; Availability: Unavailable; Value: *; MP: TB007-508-12BE; Price: None
L1 = IHLP2525CZER2R2M01: 2.2ÂµH Shielded Molded Inductor 8A 20mOhm Max Nonstandard; MF: {'manufacturer': u'Vishay'}; Price: None; Value: *; Package: None; MP: IHLP2525CZER2R2M01; Availability: Unavailable
P1-P3 = Header 6H: Header, 6-Pin, Right Angle; LatestRevisionDate: 17-Jul-2002; LatestRevisionNote: Re-released for DXP Platform.; Publisher: Altium Limited
Q1-Q24 = 2N7002: N-Channel 60V 280mA (Ta) 350mW (Ta) Surface Mount SOT-23-3 (TO-236); MF: {'manufacturer': u'ON Semiconductor'}; Value: *; MP: 2N7002; Package: None; Price: None; Availability: Unavailable
R1-R6 R13-R18 R25-R30 R37-R42 = 6-1879335-5: CPF 0603 10K 1% 50PPM 1K RL; MF: {'manufacturer': u'TE Connectivity'}; Value: *; MP: 6-1879335-5; Package: None; Price: None; Availability: Unavailable
R7-R12 R19-R24 R31-R36 R43-R48 R50 R60-R64 R69 R70 = 6-1879335-5: CPF 0603 1K 1% 50PPM 1K RL; MF: {'manufacturer': u'TE Connectivity'}; Value: *; MP: 6-1879335-5; Package: None; Price: None; Availability: Unavailable
R49 R51 = 6-1879335-5: CPF 0603 0R 1% 50PPM 1K RL; MF: {'manufacturer': u'TE Connectivity'}; Value: *; MP: 6-1879335-5; Package: None; Price: None; Availability: Unavailable
R52 R65-R68 = 6-1879335-5: CPF 0603 100R 1% 50PPM 1K RL; MF: {'manufacturer': u'TE Connectivity'}; Value: *; MP: 6-1879335-5; Package: None; Price: None; Availability: Unavailable
R53 R54 = 6-1879335-5: CPF 0603 10k 1% 50PPM 1K RL; MF: {'manufacturer': u'TE Connectivity'}; Value: *; MP: 6-1879335-5; Package: None; Price: None; Availability: Unavailable
R55 = 6-1879335-5: CPF 0603 49.9K 1% 50PPM 1K RL; MF: {'manufacturer': u'TE Connectivity'}; Value: *; MP: 6-1879335-5; Package: None; Price: None; Availability: Unavailable
R56 = 6-1879335-5: CPF 0603 3EKF1911V; MF: {'manufacturer': u'TE Connectivity'}; Value: *; MP: 6-1879335-5; Package: None; Price: None; Availability: Unavailable
R57 = 6-1879335-5: CPF 0603 ERJ3EKF1002V; MF: {'manufacturer': u'TE Connectivity'}; Value: *; MP: 6-1879335-5; Package: None; Price: None; Availability: Unavailable
R58 = 6-1879335-5: CPF 0603 ERJ-3EKF6812V; MF: {'manufacturer': u'TE Connectivity'}; Value: *; MP: 6-1879335-5; Package: None; Price: None; Availability: Unavailable
R59 = 6-1879335-5: CPF 0603 ERJ-3EKF3323V; MF: {'manufacturer': u'TE Connectivity'}; Value: *; MP: 6-1879335-5; Package: None; Price: None; Availability: Unavailable
SW1 = 1825910-2: SWITCH TACTILE SPST-NO 0.05A 24V; MF: {'manufacturer': u'TE Connectivity'}; Package: None; MP: 1825910-2; Price: None; Value: *; Availability: Unavailable
U1 = STM32F410CBU6: STM32 Dynamic Efficiency MCU with BAM, High-performance and DSP with FPU, ARM Cortex-M4 MCU with 128 Kbytes Flash; MF: {'manufacturer': u'STMicroelectronics'}; Price: None; Value: *; Package: None; MP: STM32F410CBU6; Availability: Unavailable
U6-U9 = SN74HCT273DW: MF: {'manufacturer': u'Texas Instruments'}; Availability: Unavailable; Value: *; MP: SN74HCT273DW; Package: None; Price: None
U10 = TPS54331D: MF: {'manufacturer': u'Texas Instruments'}; Price: None; Value: *; Package: None; MP: TPS54331D; Availability: Unavailable
VR1 = LM1117MPX-3.3: 800-mA 15-V linear voltage regulator 4-SOT-223 0 to 125; MF: {'manufacturer': u'Texas Instruments'}; Price: None; Availability: Unavailable; Value: *; MP: LM1117MPX-3.3; Package: None
X1 X2 = ECS-320-18-4XEN: MF: {'manufacturer': u'ECS Inc.'}; Package: None; MP: ECS-320-18-4XEN; Price: None; Value: *; Availability: Unavailable